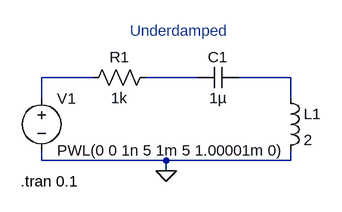
[diagram p0: schematic Underdamped LCR Circuit.asc]
Underdamped LCR Circuit.asc, the LTspice schematic file:
Version 4
SHEET 1 880 680
WIRE 144 96 64 96
WIRE 304 96 224 96
WIRE 448 96 368 96
WIRE 64 128 64 96
WIRE 448 128 448 96
WIRE 64 224 64 208
WIRE 256 224 64 224
WIRE 448 224 448 208
WIRE 448 224 256 224
WIRE 256 240 256 224
FLAG 256 240 0
SYMBOL ind 432 112 R0
SYMATTR InstName L1
SYMATTR Value 2
SYMBOL voltage 64 112 R0
WINDOW 123 0 0 Left 0
WINDOW 39 0 0 Left 0
SYMATTR InstName V1
SYMATTR Value PWL(0 0 1n 5 1m 5 1.00001m 0)
SYMBOL res 240 80 R90
WINDOW 0 0 56 VBottom 2
WINDOW 3 32 56 VTop 2
SYMATTR InstName R1
SYMATTR Value 1k
SYMBOL cap 368 80 R90
WINDOW 0 0 32 VBottom 2
WINDOW 3 32 32 VTop 2
SYMATTR InstName C1
SYMATTR Value 1µ
TEXT 32 256 Left 2 !.tran 0.1
TEXT 200 24 Left 2 ;Underdamped

The netlist it stands for:
* Underdamped LCR Circuit.asc
L1 N003 0 2
V1 N001 0 PWL(0 0 1n 5 1m 5 1.00001m 0)
R1 N002 N001 1k
C1 N003 N002 1µ
.tran 0.1
* Underdamped
.backanno
.end